# EAGLE schematic PGA-103+ LNA (EAGLE 7.7.0)
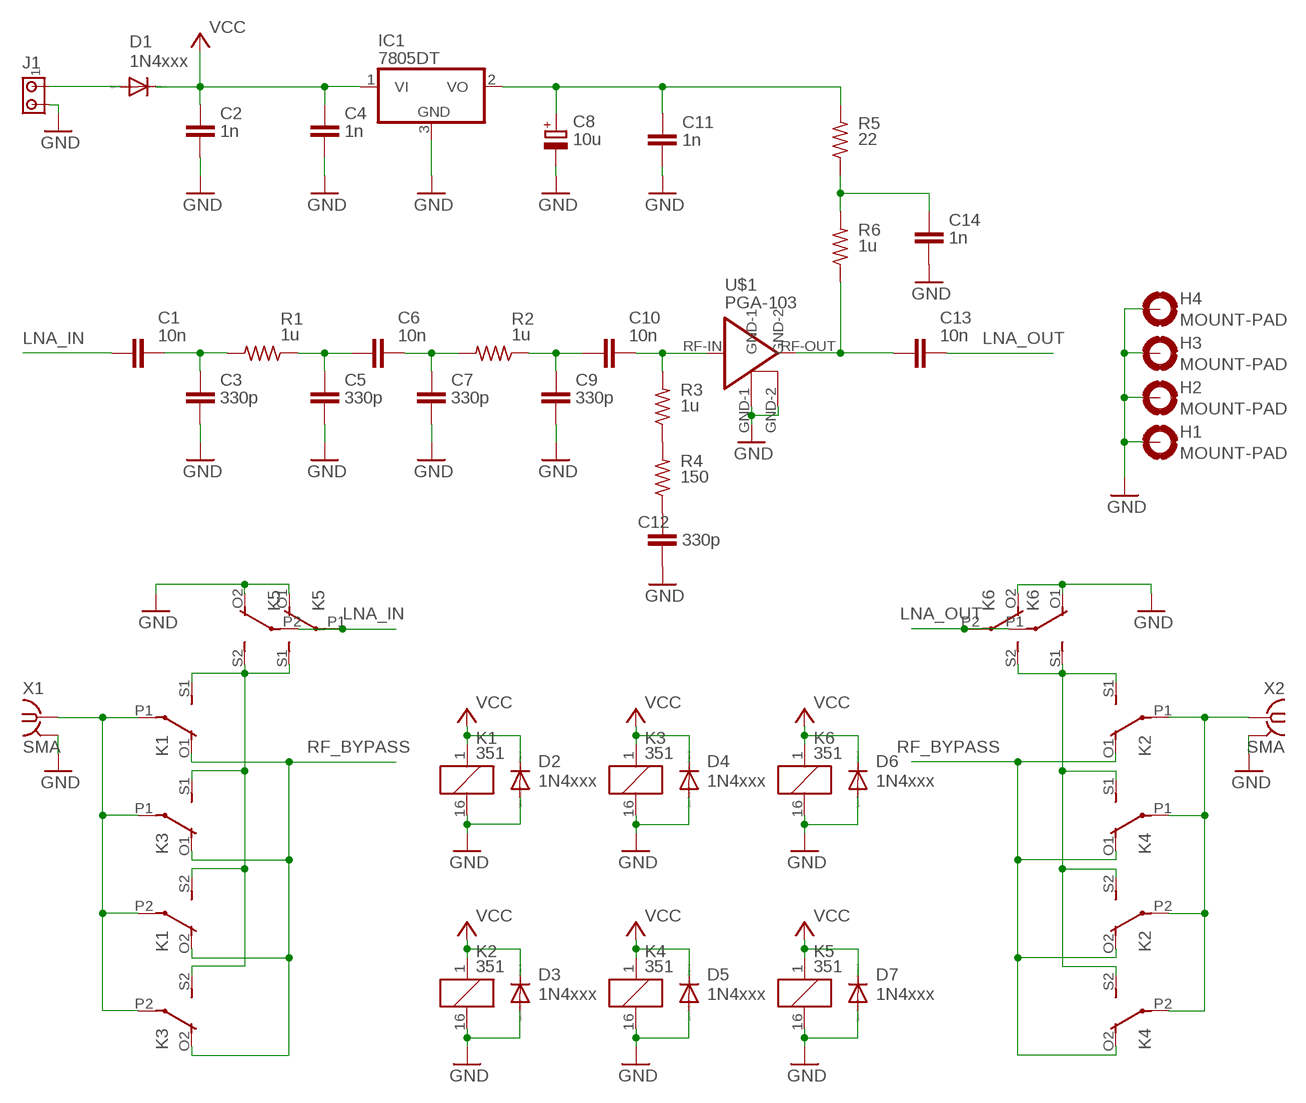
[diagram p0: schematic, sheet 1]

## Parts
C1  10n  C-EUC1206  [C1206]
C2  1n  C-EUC1206  [C1206]
C3  330p  C-EUC1206  [C1206]
C4  1n  C-EUC1206  [C1206]
C5  330p  C-EUC1206  [C1206]
C6  10n  C-EUC1206  [C1206]
C7  330p  C-EUC1206  [C1206]
C8  10u  CPOL-EUCT6032  [CT6032]
C9  330p  C-EUC1206  [C1206]
C10  10n  C-EUC1206  [C1206]
C11  1n  C-EUC1206  [C1206]
C12  330p  C-EUC1206  [C1206]
C13  10n  C-EUC1206  [C1206]
C14  1n  C-EUC1206  [C1206]
D1  1N4xxx  1N4148DO35-7  [DO35-7]
D2  1N4xxx  1N4148DO35-7  [DO35-7]
D3  1N4xxx  1N4148DO35-7  [DO35-7]
D4  1N4xxx  1N4148DO35-7  [DO35-7]
D5  1N4xxx  1N4148DO35-7  [DO35-7]
D6  1N4xxx  1N4148DO35-7  [DO35-7]
D7  1N4xxx  1N4148DO35-7  [DO35-7]
H1  MOUNT-PAD  MOUNT-PAD-ROUND2.8  [2,8-PAD]
H2  MOUNT-PAD  MOUNT-PAD-ROUND2.8  [2,8-PAD]
H3  MOUNT-PAD  MOUNT-PAD-ROUND2.8  [2,8-PAD]
H4  MOUNT-PAD  MOUNT-PAD-ROUND2.8  [2,8-PAD]
IC1  7805DT  [TO252]
J1  MTA02-156  [1X2MTA]
K1  351  [351]
K2  351  [351]
K3  351  [351]
K4  351  [351]
K5  351  [351]
K6  351  [351]
R1  1u  R-US_M1206  [M1206]
R2  1u  R-US_M1206  [M1206]
R3  1u  R-US_M1206  [M1206]
R4  150  R-US_M1206  [M1206]
R5  22  R-US_M1206  [M1206]
R6  1u  R-US_M1206  [M1206]
U$1  PGA-103  [DF782]
X1  SMA  SMA-142-0701-851/861  [J502-ND-142-0701-851/861]
X2  SMA  SMA-142-0701-851/861  [J502-ND-142-0701-851/861]

## Nets
ANT: K1.P1(2:P) K1.P2(3:P) K3.P1(2:P) K3.P2(3:P) X1.1
GND: C2.2 C3.1 C4.2 C5.1 C7.1 C8.- C9.1 C11.2 C12.1 C14.1 D2.A D3.A D4.A D5.A D6.A D7.A H1.B2,8(MOUNT) H2.B2,8(MOUNT) H3.B2,8(MOUNT) H4.B2,8(MOUNT) IC1.3(GND) J1.2 K1.16 K2.16 K3.16 K4.16 K5.16 K5.O1(2:O) K5.O2(3:O) K6.16 K6.O1(2:O) K6.O2(3:O) U$1.GND-1 U$1.GND-2 X1.G@1 X1.G@2 X1.G@3 X1.G@4 X2.G@1 X2.G@2 X2.G@3 X2.G@4
LNA_IN: C1.1 K5.P1(2:P) K5.P2(3:P)
LNA_OUT: C13.2 K6.P1(2:P) K6.P2(3:P)
N$1: C10.2 R3.2 U$1.RF-IN
N$3: C13.1 R6.1 U$1.RF-OUT
N$5: C8.+ C11.1 IC1.2(VO) R5.2
N$7: D1.A J1.1
N$8: C9.2 C10.1 R2.1
N$9: C14.2 R5.1 R6.2
N$10: R3.1 R4.2
N$11: C12.2 R4.1
N$12: C6.2 C7.2 R2.2
N$13: C5.2 C6.1 R1.1
N$14: C1.2 C3.2 R1.2
N$16: K1.S1(2:S) K1.S2(3:S) K3.S1(2:S) K3.S2(3:S) K5.S1(2:S) K5.S2(3:S)
N$17: K2.S1(2:S) K2.S2(3:S) K4.S1(2:S) K4.S2(3:S) K6.S1(2:S) K6.S2(3:S)
RF_BYPASS: K1.O1(2:O) K1.O2(3:O) K2.O1(2:O) K2.O2(3:O) K3.O1(2:O) K3.O2(3:O) K4.O1(2:O) K4.O2(3:O)
TRX: K2.P1(2:P) K2.P2(3:P) K4.P1(2:P) K4.P2(3:P) X2.1
VCC: C2.1 C4.1 D1.C D2.C D3.C D4.C D5.C D6.C D7.C IC1.1(VI) K1.1 K2.1 K3.1 K4.1 K5.1 K6.1

## Library data of the parts
C1-C7 C9-C14 = rcl:C-EU: CAPACITOR, European symbol
C8 = rcl:CPOL-EU: POLARIZED CAPACITOR, European symbol
D1-D7 = diode:1N4148: DIODE high speed (Philips)
H1-H4 = holes:MOUNT-PAD-ROUND: MOUNTING PAD, round
IC1 = linear:78*: Positive VOLTAGE REGULATOR Source: http://cache.national.com/ds/LM/LM78L05.pdf http://www.fairchildsemi.com/ds/LM/LM7805.pdf
J1 = con-amp:MTA02-156: AMP connector
K1-K6 = relay:351: RELAY 2 x switch, Omron; OC_FARNELL: unknown; OC_NEWARK: unknown
R1-R6 = rcl:R-US_: RESISTOR, American symbol
U$1 = minicircuits:PGA-103
X1 X2 = con-coax:SMA-: SMA 50 Ohm End Launch Jack Receptacle - Round Contact Johnson Components Source: www.johnsoncomponents.com .. J502-ND.pdf; MF: JOHNSON COMPONENTS; MPN: 142-0701-851; OC_FARNELL: 1019325; OC_NEWARK: 99F6798